# Altium project hub_2.0.PrjPCB
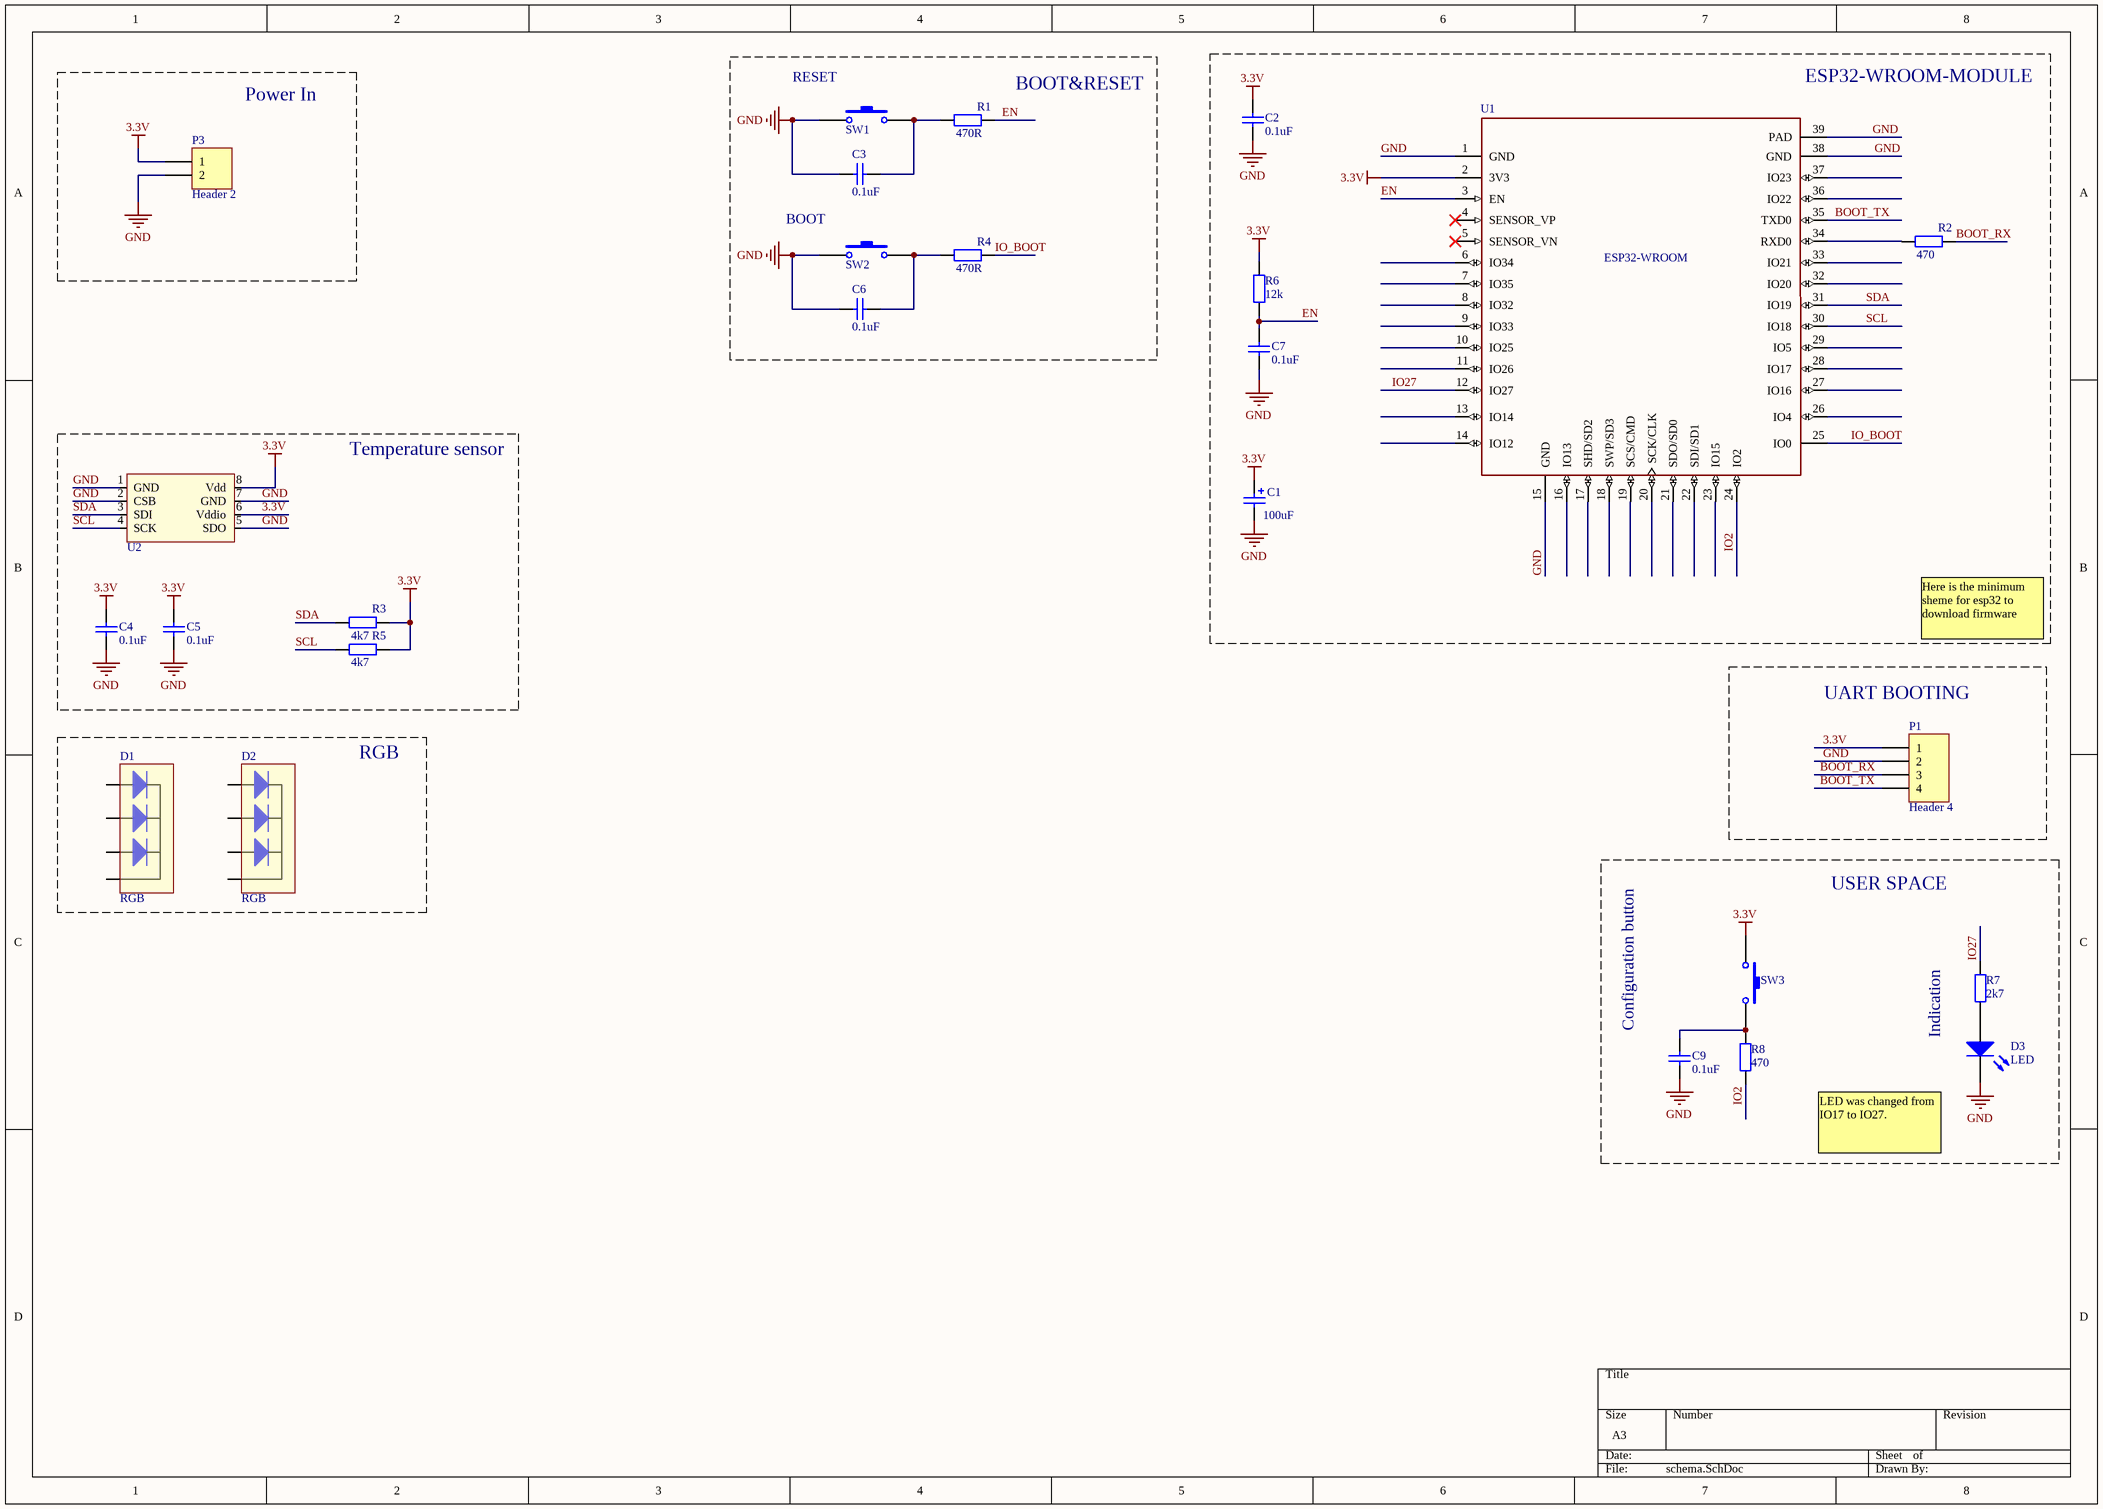
[diagram p0: schema.SchDoc]
1 sheet, 26 parts. Net scope: global (net labels, ports and power ports of the same name join across sheets).
Board file: pcb_esp32.PcbDoc

## Sheet schema.SchDoc
size A3

### Parts
C1  Voltage: 100uF  [SMD CAP ALU SIZE D]  (hidden comment: capacitor)
C2  Capacitance: 0.1uF  [SMD 0603 CAP]  (hidden comment: Cap non-polar)
C3  Capacitance: 0.1uF  [SMD 0603 CAP]  (hidden comment: Cap non-polar)
C4  Capacitance: 0.1uF  [SMD 0603 CAP]  (hidden comment: Cap non-polar)
C5  Capacitance: 0.1uF  [SMD 0603 CAP]  (hidden comment: Cap non-polar)
C6  Capacitance: 0.1uF  [SMD 0603 CAP]  (hidden comment: Cap non-polar)
C7  Capacitance: 0.1uF  [SMD 0603 CAP]  (hidden comment: Cap non-polar)
C9  Capacitance: 0.1uF  [SMD 0603 CAP]  (hidden comment: Cap non-polar)
D1  RGB  [RGB 5mm]
D2  RGB  [RGB 5mm]
D3  LED  [LED 5mm round]
P1  Header 4  [HDR1X4]
P3  Header 2  [HDR1X2]
R1  Res: 470R  [SMD 0603 RES]  (hidden comment: Resistor)
R2  Res: 470  [SMD 0603 RES]  (hidden comment: Resistor)
R3  Res: 4k7  [SMD 0603 RES]  (hidden comment: Resistor)
R4  Res: 470R  [SMD 0603 RES]  (hidden comment: Resistor)
R5  Res: 4k7  [SMD 0603 RES]  (hidden comment: Resistor)
R6  Res: 12k  [SMD 0603 RES]  (hidden comment: Resistor)
R7  Res: 2k7  [SMD 0603 RES]  (hidden comment: Resistor)
R8  Res: 470  [SMD 0603 RES]  (hidden comment: Resistor)
SW1  Button  [Button reset]  (value not drawn)
SW2  Button  [Button tact_3x6mm]  (value not drawn)
SW3  Button  [Button tact_3x6mm]  (value not drawn)
U1  ESP32-WROOM  [ESP_WROOM_32]
U2  temp sensor  [LGA]  (value not drawn)

### Nets
3.3V: C1.1(A) C2.2 C4.2 C5.2 P1.1 P3.1 R3.2 R5.2 R6.2 SW3.1 U1.2(3V3) U2.6(Vddio) U2.8(Vdd)
GND: C1.2(K) C2.1 C3.2 C4.1 C5.1 C6.2 C7.1 C9.1 D3.2(K) P1.2 P3.2 SW1.1 SW2.1 U1.1(GND) U1.15(GND) U1.38(GND) U1.39(PAD) U2.1(GND) U2.2(CSB) U2.5(SDO) U2.7(GND)
BOOT_RX: P1.3 R2.2
BOOT_TX: P1.4 U1.35(TXD0)
EN: C7.2 R1.2 R6.1 U1.3(EN)
IO2: R8.1 U1.24(IO2)
IO27: R7.2 U1.12(IO27)
IO_BOOT: R4.2 U1.25(IO0)
SCL: R5.1 U1.30(IO18) U2.4(SCK)
SDA: R3.1 U1.31(IO19) U2.3(SDI)
NetC3_1: C3.1 R1.1 SW1.2
NetC6_1: C6.1 R4.1 SW2.2
NetC9_2: C9.2 R8.2 SW3.2
NetD3_1: D3.1(A) R7.1
NetR2_1: R2.1 U1.34(RXD0)

Not connected (* = marked no-connect by the designer): D1 1(A) 2(GND) 3 4(A); D2 1(A) 2(GND) 3 4(A); U1 4(SENSOR_VP)* 5(SENSOR_VN)* 6(IO34) 7(IO35) 8(IO32) 9(IO33) 10(IO25) 11(IO26) 13(IO14) 14(IO12) 16(IO13) 17(SHD/SD2) 18(SWP/SD3) 19(SCS/CMD) 20(SCK/CLK) 21(SDO/SD0) 22(SDI/SD1) 23(IO15) 26(IO4) 27(IO16) 28(IO17) 29(IO5) 32(IO20) 33(IO21) 36(IO22) 37(IO23)

### Notes on the sheet
- Power In
- (near SW1) RESET
- (near R1) BOOT&RESET
- (near U1) ESP32-WROOM-MODULE
- BOOT
- Temperature sensor
- Here is the minimum sheme for esp32 to download firmware
- (near P1) UART BOOTING
- RGB
- USER SPACE
- (near C9) Configuration button
- Indication
- LED was changed from IO17 to IO27.

### Library data of the parts
C1 = Cap_pol: Capac: CE010M0100RED-0605; Link: https://imrad.com.ua/ru/ce010m0100red-0605
D1 D2 = RGB_CC: Manuf data: GNL-5013RGBC-TL-C; Link: https://www.rcscomponents.kiev.ua/product/svetodiod-rgb-5mm-628-525-470nm-25-gnl-5013rgbc-tl-c_52890.html; Price: 8.5
D3 = LED: Typical BLUE SiC LED; Published: 8-Jun-2000; LatestRevisionDate: 17-Dec-2003; LatestRevisionNote: PCB Footprint replaced.; DatasheetVersion: 16-Apr-2002; PackageVersion: 16-Apr-2002; PackageReference: 3.5X2.8X1.9; Publisher: Altium Limited; PackageDescription: SM LED; 2 C-Bend Leads; Body 3.5 x 2.8 x 1.9 mm, inc leads (LxWxH typ)
P1 = Header 4: Header, 4-Pin; LatestRevisionDate: 17-Jul-2002; LatestRevisionNote: Re-released for DXP Platform.; Publisher: Altium Limited
P3 = Header 2: Header, 2-Pin; LatestRevisionDate: 17-Jul-2002; LatestRevisionNote: Re-released for DXP Platform.; Publisher: Altium Limited
SW1 SW3 = Button: Product name: SWT-3/8 or KLS7-TS6606; Link: https://www.rcscomponents.kiev.ua/product/swt-3-8-kls7-ts6606-8-0-180_126851.html
SW2 = Button: Product name: TACTM-34-NF; Link: https://www.rcscomponents.kiev.ua/product/tactm-34n-f-ninigi-mikropereklyuchatel-taktovaya-knopka-1-spst-no-0-05a-12vdc-smt-1-6n-3x6mm_88422.html
U1 = ESP32-WROOM: Manuf data: esp-32 wrrom; Price: *; Link: *
U2 = bme280: Manuf data: *; Link: *; Price: *
C2-C7 C9 = Cap non-polar: Manuf data: *; Voltage: *; Price: *; Link: *
R1-R8 = Resistor: Manuf data: *; Link: *; Power: *; Price: *